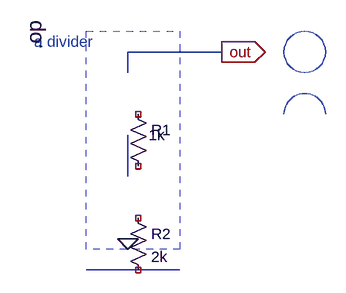
[diagram p0: schematic shuffled.asc]
shuffled.asc, the LTspice schematic file:
Version 4
SHEET 1 880 680
TEXT 16 48 Left 2 ;a divider
SYMBOL res 160 304 R0
SYMATTR Value 2k
SYMATTR InstName R2
FLAG 304 64 out
IOPIN 304 64 Out
RECTANGLE Normal 96 32 240 368 2
WIRE 304 64 160 64
SYMBOL res 160 144 R0
WINDOW 3 32 48 Left 2
SYMATTR InstName R1
SYMATTR Value 1k
SYMATTR SpiceLine tol=1
LINE Normal 96 400 240 400
TEXT 16 16 VRight 3 !.op
WIRE 160 256 160 192
FLAG 160 352 0
WIRE 160 96 160 64
CIRCLE Normal 400 32 464 96
ARC Normal 400 128 464 192 464 160 400 160

The netlist it stands for:
* shuffled.asc
R2 NC_01 NC_02 2k
R1 NC_03 NC_04 1k tol=1
* a divider
.op
.backanno
.end